# EAGLE design murdock_mcu (EAGLE 6.2)

## Sheet 1 of 2
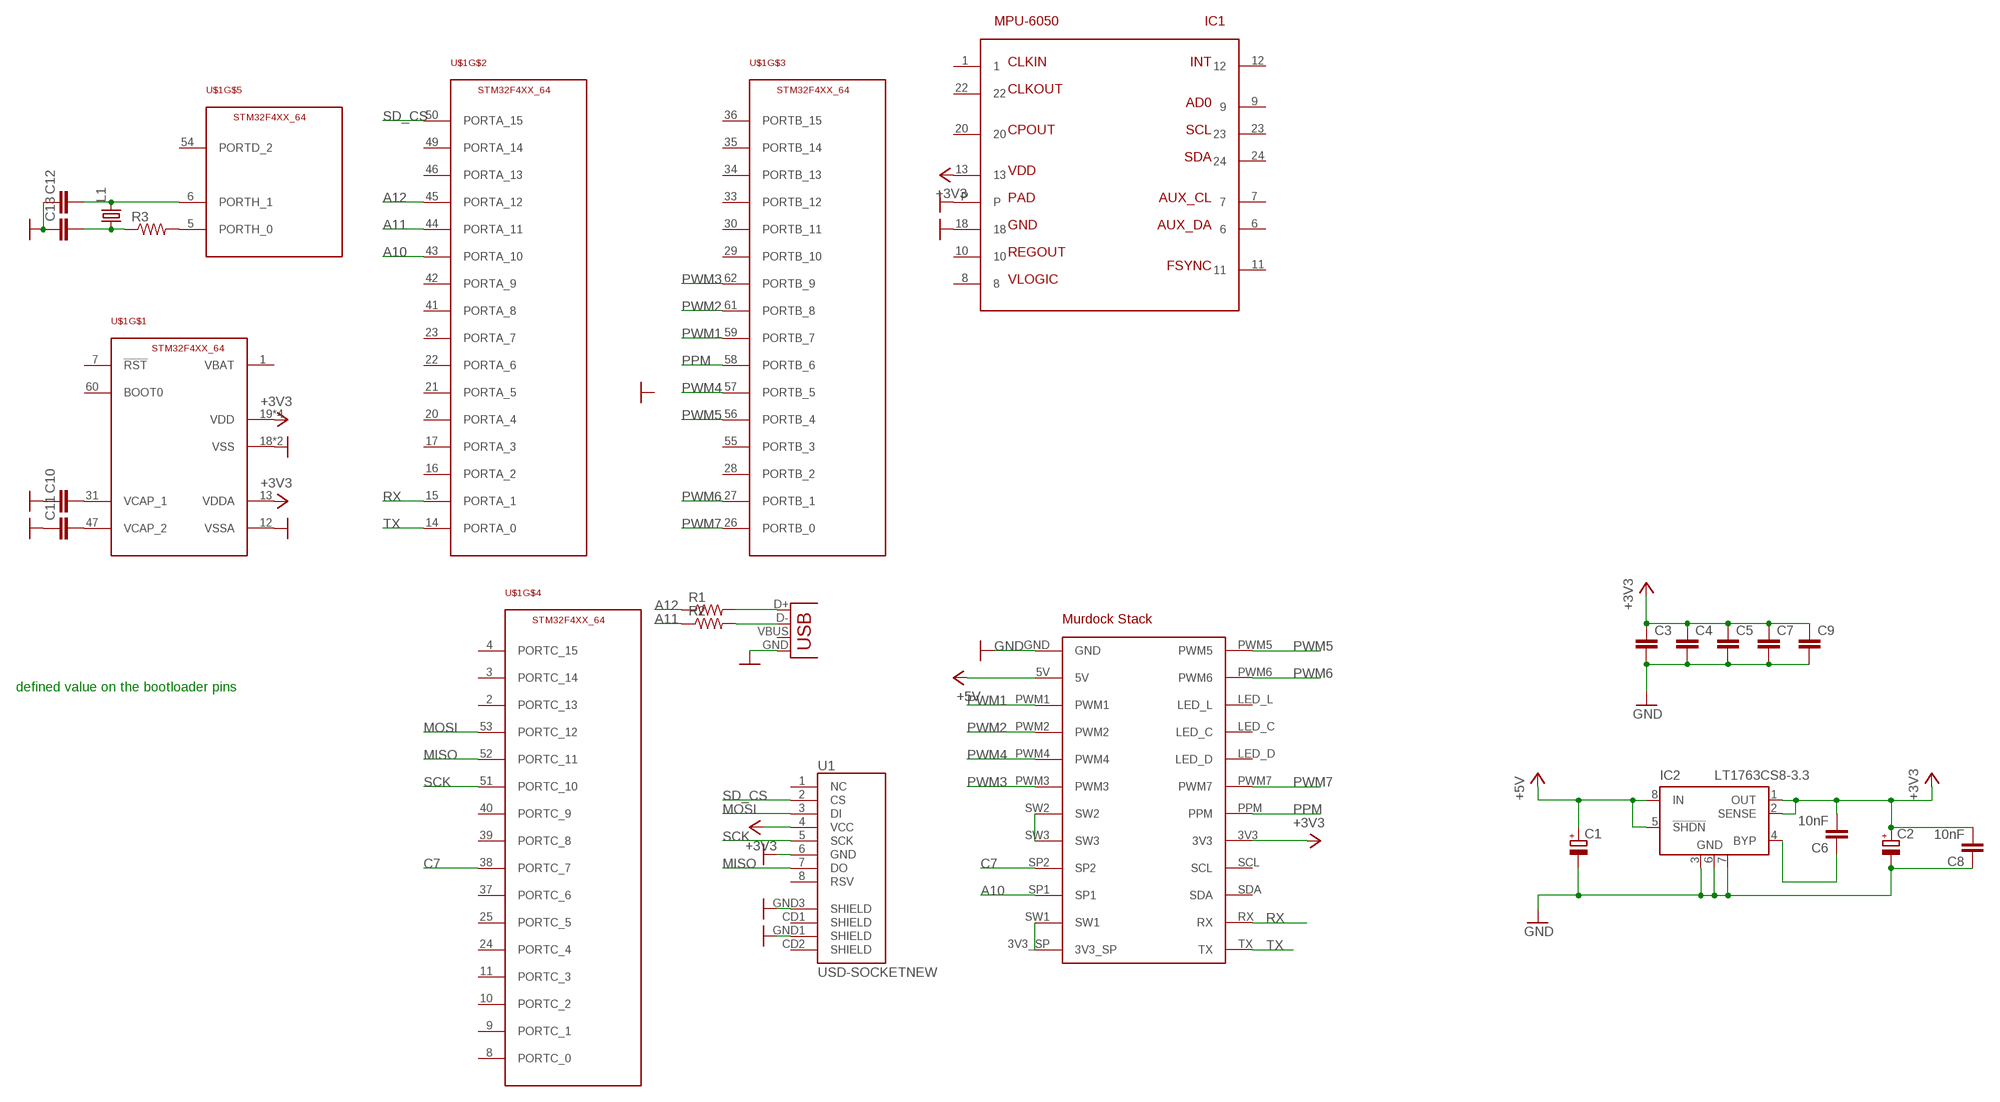
[diagram p0: schematic, sheet 1]

### Parts
C1  CPOL-EUSMCD  [SMC_D]
C2  CPOL-EUSMCD  [SMC_D]
C3  CAP0402-CAP  [0402-CAP]
C4  CAP0402-CAP  [0402-CAP]
C5  CAP0402-CAP  [0402-CAP]
C6  10nF  C-EUC0402  [C0402]
C7  CAP0402-CAP  [0402-CAP]
C8  10nF  C-EUC0402  [C0402]
C9  CAP0402-CAP  [0402-CAP]
C10  CAP0805  [0805]
C11  CAP0805  [0805]
C12  CAP0402-CAP  [0402-CAP]
C13  CAP0402-CAP  [0402-CAP]
IC1  MPU-6050  [QFN24]
IC2  LT1763CS8-3.3  [SOIC8]
L1  X22-OSCILLATOR  [X22]
R1  RESISTOR0402-RES  [0402-RES]
R2  RESISTOR0402-RES  [0402-RES]
R3  RESISTOR0402-RES  [0402-RES]
U1  USD-SOCKETNEW  [MICRO-SD-SOCKET-PP]
U$1  STM32F4XX_64  [TQFP64]
X1  USBSMD  [USB-MINIB]
X2  MURDOCK_STACK  [MURDOCK_STACK]

### Nets
+3V3: C2.+ C3.1 C4.1 C5.1 C6.2 C7.1 C8.2 C9.1 IC1.13 IC2.1(OUT) IC2.2(SENSE) U1.4(VCC) U$1.13(VDDA) U$1.19(VDD) U$1.32(VDD) U$1.48(VDD) U$1.64(VDD) X2.3V3
+5V: C1.+ IC2.5(!SHDN) IC2.8(IN) X2.5V
A10: U$1.43(PORTA_10) X2.SP1
A11: R2.1 U$1.44(PORTA_11)
A12: R1.1 U$1.45(PORTA_12)
C7: U$1.38(PORTC_7) X2.SP2
GND: C1.- C2.- C3.2 C4.2 C5.2 C7.2 C8.1 C9.2 C10.1 C11.1 C12.1 C13.1 IC1.18 IC1.P IC2.3(GND) IC2.6(GND) IC2.7(GND) U1.6(GND) U1.GND1(SHIELD) U1.GND3(SHIELD) U$1.12(VSSA) U$1.18(VSS) U$1.63(VSS) X1.GND X2.GND
MISO: U1.7(DO) U$1.52(PORTC_11)
MOSI: U1.3(DI) U$1.53(PORTC_12)
N$1: R2.2 X1.D-
N$2: R1.2 X1.D+
N$3: C10.2 U$1.31(VCAP_1)
N$4: C11.2 U$1.47(VCAP_2)
N$5: R3.2 U$1.5(PORTH_0)
N$6: C13.2 L1.1 R3.1
N$7: C12.2 L1.3 U$1.6(PORTH_1)
N$8: X2.3V3_SP X2.SW1
N$9: X2.SW2 X2.SW3
N$13: C6.1 IC2.4(BYP)
PPM: U$1.58(PORTB_6) X2.PPM
PWM1: U$1.59(PORTB_7) X2.PWM1
PWM2: U$1.61(PORTB_8) X2.PWM2
PWM3: U$1.62(PORTB_9) X2.PWM3
PWM4: U$1.57(PORTB_5) X2.PWM4
PWM5: U$1.56(PORTB_4) X2.PWM5
PWM6: U$1.27(PORTB_1) X2.PWM6
PWM7: U$1.26(PORTB_0) X2.PWM7
RX: U$1.15(PORTA_1) X2.RX
SCK: U1.5(SCK) U$1.51(PORTC_10)
SD_CS: U1.2(CS) U$1.50(PORTA_15)
TX: U$1.14(PORTA_0) X2.TX
Unconnected: IC1.1 IC1.6 IC1.7 IC1.8 IC1.9 IC1.10 IC1.11 IC1.12 IC1.20 IC1.22 IC1.23 IC1.24 U1.1(NC) U1.8(RSV) U1.CD1(SHIELD) U1.CD2(SHIELD) U$1.1(VBAT) U$1.2(PORTC_13) U$1.3(PORTC_14) U$1.4(PORTC_15) U$1.7(!RST) U$1.8(PORTC_0) U$1.9(PORTC_1) U$1.10(PORTC_2) U$1.11(PORTC_3) U$1.16(PORTA_2) U$1.17(PORTA_3) U$1.20(PORTA_4) U$1.21(PORTA_5) U$1.22(PORTA_6) U$1.23(PORTA_7) U$1.24(PORTC_4) U$1.25(PORTC_5) U$1.28(PORTB_2) U$1.29(PORTB_10) U$1.30(PORTB_11) U$1.33(PORTB_12) U$1.34(PORTB_13) U$1.35(PORTB_14) U$1.36(PORTB_15) U$1.37(PORTC_6) U$1.39(PORTC_8) U$1.40(PORTC_9) U$1.41(PORTA_8) U$1.42(PORTA_9) U$1.46(PORTA_13) U$1.49(PORTA_14) U$1.54(PORTD_2) U$1.55(PORTB_3) U$1.60(BOOT0) X1.VBUS X2.LED_C X2.LED_D X2.LED_L X2.SCL X2.SDA

### Notes on the sheet
- defined value on the bootloader pins

## Sheet 2 of 2

## Library data of the parts
C1 C2 = rcl:CPOL-EU: POLARIZED CAPACITOR, European symbol
C3-C5 C7 C9-C13 = SparkFun-Capacitors:CAP: Capacitor Standard 0603 ceramic capacitor, and 0.1" leaded capacitor.
C6 C8 = rcl:C-EU: CAPACITOR, European symbol
IC1 = seb:MPU-6050
IC2 = linear-technology:LT1763CS8: 500mA, Low Noise, LDO Micropower Regulators Source: http://cds.linear.com/docs/Datasheet/1763ff.pdf
L1 = seb:X22-OSCILLATOR
R1-R3 = SparkFun-Resistors:RESISTOR: Resistor Basic schematic elements and footprints for 0603, 1206, and PTH resistors.
U1 = SparkFun-Connectors:USD-SOCKET: microSD Socket Push-push type uSD socket. Schematic element and footprint production proven. Spark Fun Electronics SKU : PRT-00127. tDoc lines correctly indicate media card edge positions when inserting (unlocked, locked, depressed).
U$1 = stm32:STM32F4XX_64
X1 = SparkFun-Connectors:USB: USB Connectors USB-B-PTH is fully proven SKU : PRT-00139 USB-miniB is fully proven SKU : PRT-00587 USB-A-PCB is untested. USB-A-H is throughly reviewed, but untested. Spark Fun Electronics SKU : PRT-00437 USB-B-SMT is throughly reviewed, but untested. Needs silkscreen touching up. USB-A-S has not been used/tested USB-MB-H has not been used/tested
X2 = murdock:MURDOCK_STACK

## Board
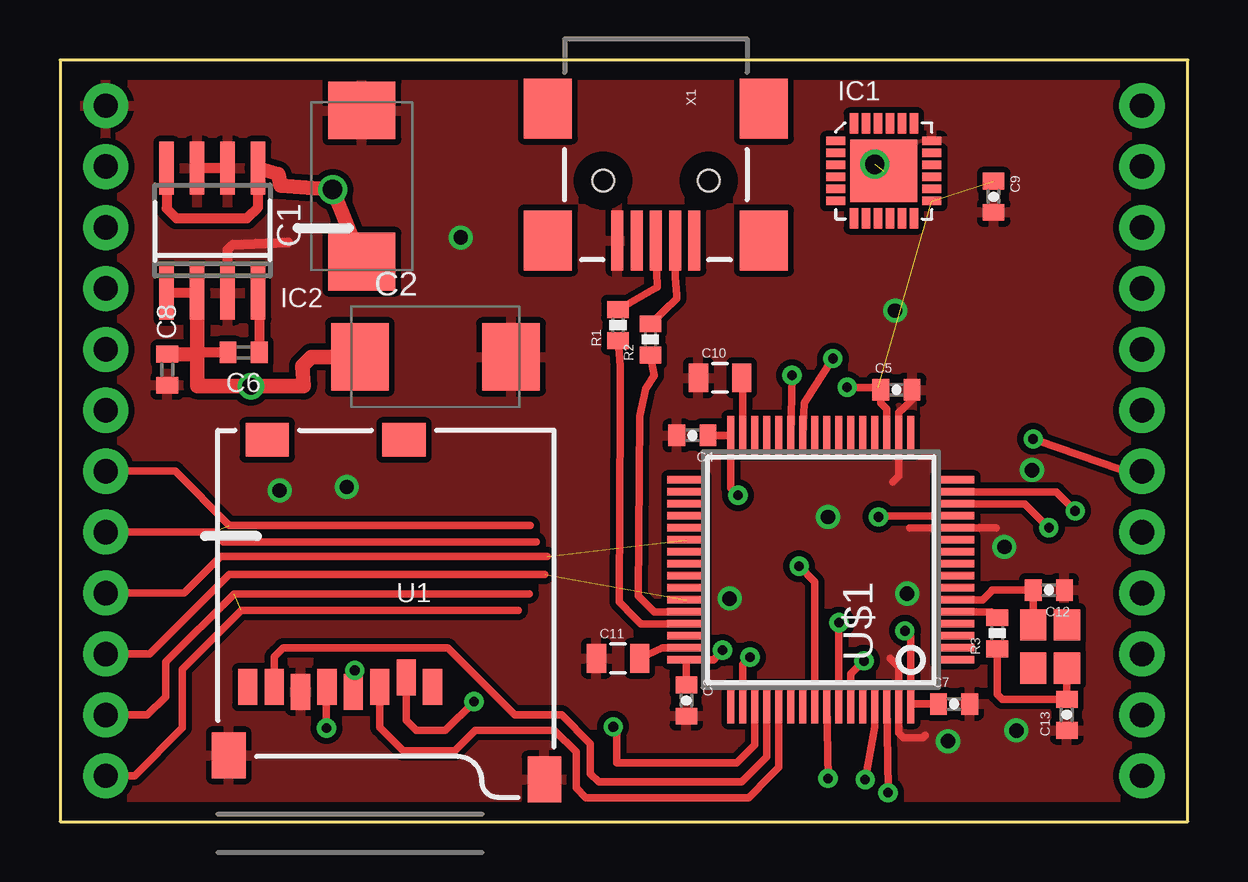
[diagram p1: board, top side]
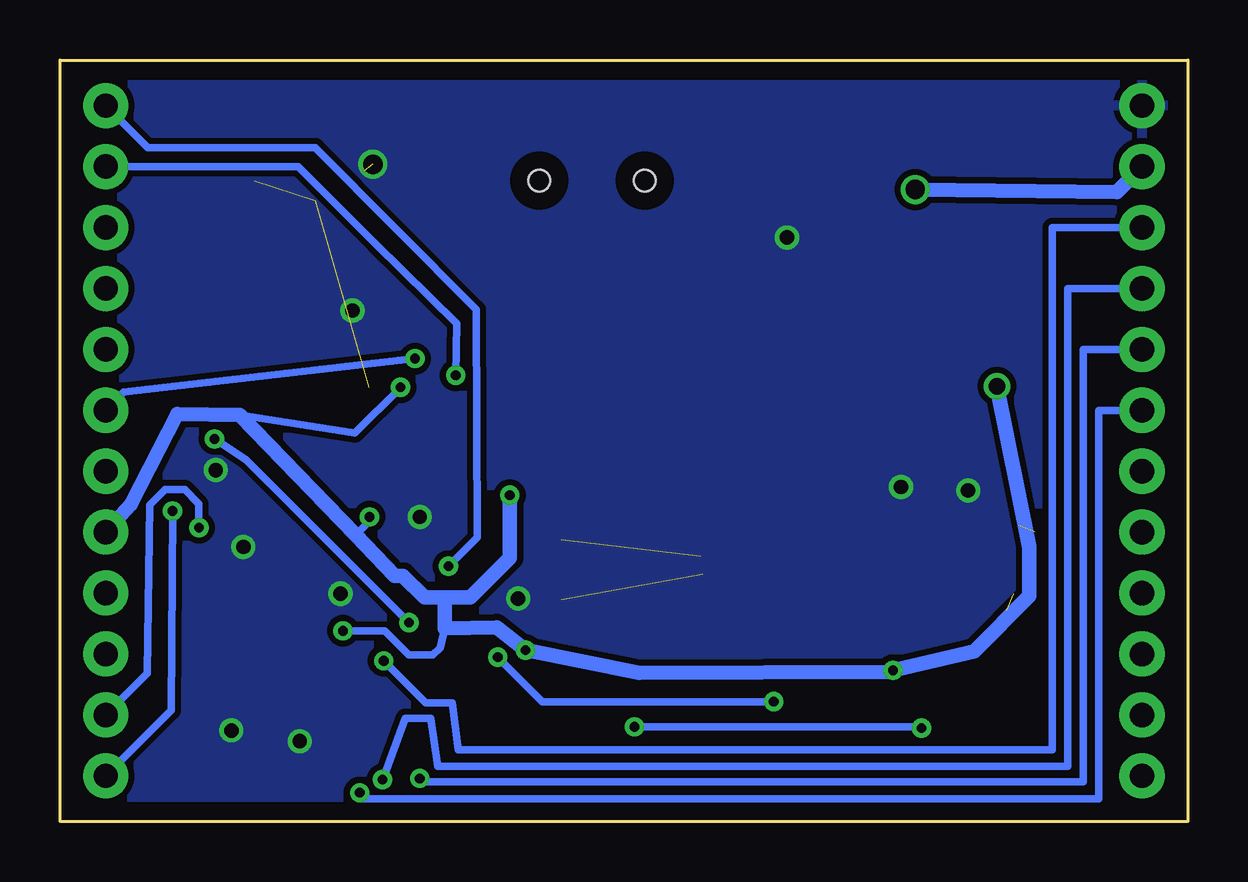
[diagram p2: board, bottom side, seen from below]

Size 46.99 x 31.75 mm. Coordinates in mm from the lower left corner, seen from the top.
Copper layers (1*16): Top 0.035mm / dielectric 1.5mm / Bottom 0.035mm
Design rules: minimum track width 10mil, minimum drill 0.4mm, track to track 8mil, track to pad 8mil, pad to pad 8mil, via to via 8mil, smd to smd 8mil, copper to edge 30mil, drill to drill 8mil, minimum pad ring 10mil, minimum via ring 8mil, stop-mask expansion 4mil, vias tented up to drill 1.5mm, thermal gap 10mil

### Footprints (pad centres in the part's own frame; a part is rotated, then mirrored left to right if it is on the bottom)
SMC_D = smd 2.4 x 2.8: + -3.15,0; - 3.15,0
0402-CAP = smd 0.7 x 0.9: 1 -0.65,0; 2 0.65,0
C0402 = smd 0.7 x 0.9: 1 -0.65,0; 2 0.65,0
0805 = smd 0.8 x 1.2: 1 -0.9,0; 2 0.9,0
QFN24 = smd 0.8 x 0.35: 1 -2,1.25; 2 -2,0.75; 3 -2,0.25; 4 -2,-0.25; 5 -2,-0.75; 6 -2,-1.25; 13 2,-1.25; 14 2,-0.75; 15 2,-0.25; 16 2,0.25; 17 2,0.75; 18 2,1.25 | smd 0.35 x 0.85: 7 -1.25,-1.975; 8 -0.75,-1.975; 9 -0.25,-1.975; 10 0.25,-1.975; 11 0.75,-1.975; 12 1.25,-1.975; 19 1.25,1.975; 20 0.75,1.975; 21 0.25,1.975; 22 -0.25,1.975; 23 -0.75,1.975; 24 -1.25,1.975 | smd 2.8 x 2.6: P 0,0
SOIC8 = smd 0.6 x 2.2: 1 -1.905,-2.6; 2 -0.635,-2.6; 3 0.635,-2.6; 4 1.905,-2.6; 5 1.905,2.6; 6 0.635,2.6; 7 -0.635,2.6; 8 -1.905,2.6
X22 = smd 1.3 x 1.1: 1 0.9,0.7; 2 -0.9,0.7; 3 -0.9,-0.7; 4 0.9,-0.7
0402-RES = smd 0.7 x 0.9: 1 -0.65,0; 2 0.65,0
MICRO-SD-SOCKET-PP = smd 0.8 x 1.5: 1 -8.94,10.7; 2 -7.84,10.3; 3 -6.74,10.7; 4 -5.64,10.9; 5 -4.54,10.7; 6 -3.44,10.9; 7 -2.34,10.7; 8 -1.24,10.7 | smd 1.8 x 1.4: CD1 -2.05,0.4; CD2 -7.75,0.4 | smd 1.4 x 1.9: GND1 -13.6,14.55; GND3 -0.45,13.55
TQFP64 = smd 0.3 x 1.6: 1 -3.75,-5.6; 2 -3.25,-5.6; 3 -2.75,-5.6; 4 -2.25,-5.6; 5 -1.75,-5.6; 6 -1.25,-5.6; 7 -0.75,-5.6; 8 -0.25,-5.6; 9 0.25,-5.6; 10 0.75,-5.6; 11 1.25,-5.6; 12 1.75,-5.6; 13 2.25,-5.6; 14 2.75,-5.6; 15 3.25,-5.6; 16 3.75,-5.6; 33 3.75,5.6; 34 3.25,5.6; 35 2.75,5.6; 36 2.25,5.6; 37 1.75,5.6; 38 1.25,5.6; 39 0.75,5.6; 40 0.25,5.6; 41 -0.25,5.6; 42 -0.75,5.6; 43 -1.25,5.6; 44 -1.75,5.6; 45 -2.25,5.6; 46 -2.75,5.6; 47 -3.25,5.6; 48 -3.75,5.6 | smd 1.6 x 0.3: 17 5.6,-3.75; 18 5.6,-3.25; 19 5.6,-2.75; 20 5.6,-2.25; 21 5.6,-1.75; 22 5.6,-1.25; 23 5.6,-0.75; 24 5.6,-0.25; 25 5.6,0.25; 26 5.6,0.75; 27 5.6,1.25; 28 5.6,1.75; 29 5.6,2.25; 30 5.6,2.75; 31 5.6,3.25; 32 5.6,3.75; 49 -5.6,3.75; 50 -5.6,3.25; 51 -5.6,2.75; 52 -5.6,2.25; 53 -5.6,1.75; 54 -5.6,1.25; 55 -5.6,0.75; 56 -5.6,0.25; 57 -5.6,-0.25; 58 -5.6,-0.75; 59 -5.6,-1.25; 60 -5.6,-1.75; 61 -5.6,-2.25; 62 -5.6,-2.75; 63 -5.6,-3.25; 64 -5.6,-3.75
USB-MINIB = smd 2.5 x 0.5: D+ 2.5,0; D- 2.5,0.8; GND 2.5,-1.6; ID 2.5,-0.8; VBUS 2.5,1.6 | smd 2.5 x 2: MTN1 -3,4.5; MTN2 2.5,4.5; MTN3 -3,-4.5; MTN4 2.5,-4.5 | hole 0.9: 0,2.2; 0,-2.2
MURDOCK_STACK = drill 1.016 pad 1.88: 3V3 19.685,45.085; 3V3_SP 29.845,1.905; 5V 4.445,1.905; GND 1.905,1.905; LED_C 9.525,45.085; LED_D 12.065,45.085; LED_L 6.985,45.085; PPM 17.145,45.085; PWM1 6.985,1.905; PWM2 9.525,1.905; PWM3 14.605,1.905; PWM4 12.065,1.905; PWM5 1.905,45.085; PWM6 4.445,45.085; PWM7 14.605,45.085; RX 29.845,45.085; SCL 22.225,45.085; SDA 24.765,45.085; SP1 24.765,1.905; SP2 22.225,1.905; SW1 27.305,1.905; SW2 17.145,1.905; SW3 19.685,1.905; TX 27.305,45.085

### Placement (x,y rotation side)
C1  12.58,26.49 90 top
C2  15.64,19.37 0 top
C3  26.1,5.05 270 top
C4  26.35,16.1 180 top
C5  34.85,18 0 top
C6  7.65,19.55 180 top
C7  37.25,4.9 0 top
C8  4.47,18.84 90 top
C9  38.9,26.05 270 top
C10  27.5,18.5 0 top
C11  23.25,6.8 0 top
C12  41.2,9.65 180 top
C13  41.95,4.45 90 top
IC1  34.33,27.12 0 top
IC2  6.35,24.64 0 top
L1  41.25,7.3 270 top
R1  23.25,20.7 90 top
R2  24.6,20.1 90 top
R3  39.05,7.85 90 top
U1  6.58,16.31 180 top
U$1  31.7,10.5 90 top
X1  24.83,26.72 270 top
X2  0,31.75 270 top

### Tracks (layer width: path | path; a pad name or v marks a point on that pad's centre or on a via)
+3V3  (via drill 0.4, 0.7)  (2 unrouted)
  Top 0.305: U$1.19 34.45,17.2 34.3,17.35 34.2,17.45 | 34.2,17.45 C5.1 | C3.1 U$1.48 27.25,6.75 v27.6,7.15 | C4.1 U$1.32 27.95,13.9 v28.25,13.6 | 34.2,17.45 C5.1 | C5.1 34.1,18.1 v32.8,18.1 | C7.1 U$1.64 35.45,7.7 v35.2,7.95 | U$1.13 34.15,12.75 v34.1,12.7 | U1.4 12.28,5.47 v12.28,6.3
  Top 0.406: C6.2 5.71,19.55 IC2.2 IC2.1 4.45,22.11
  Top 0.61: 5.71,19.47 5.71,18.27 5.71,19.47 | 5.71,19.47 IC2.2 | C8.2 5.71,19.47 | 5.71,19.47 5.71,18.16 v7.95,18.16 v7.95,18.15 10.15,18.15 10.1,19 10.47,19.37 C2.+
  Bottom 0.305: v32.8,18.1 34.7,16.2 39.5,16.95 | v35.2,7.95 33.45,7.95 32.45,6.95 31.45,6.95 31.15,7.25 30.95,8.05 | v34.1,12.7 34.1,12.52 34.68,11.94 | v12.28,6.3 12.24,6.34 12.1,6.34
  Bottom 0.61: X2.3V3 44.03,13.21 42.1,17 39.5,16.95 34.68,11.94 33.05,10.25 32.7,10.25 31.8,9.35 31.1,9.35 | v28.25,13.6 28.25,11 29.9,9.35 31.1,9.35 | 31.1,9.35 30.95,9.2 30.95,8.05 28.8,8.1 v27.6,7.15 22.85,6.2 12.5,6.25 v12.28,6.3 12.1,6.34 8.9,7.1 6.6,9.4 6.6,11.45 v7.95,18.15
+5V  (via drill 0.8)
  Top 0.406: IC2.8 4.45,25.55 4.85,25.15 7.8,25.15 8.25,25.6 IC2.5
  Top 0.61: IC2.5 9.09,26.98 9.21,26.51 v11.36,26.35 C1.+
  Bottom 0.61: X2.5V 2.96,26.25 v11.36,26.35
A10  (1 unrouted)
  Top 0.305: X2.SP1 3.73,6.99 7.05,10.3 20.2,10.3
A11
  Top 0.305: U$1.44 24.75,8.75 24.1,9.4 24.15,16.9 24.4,18.05 24.75,18.6 R2.1
A12
  Top 0.305: R1.1 23.35,19 23.35,17.15 23.3,9.15 23.95,8.5 24.2,8.25 U$1.45
C7  (1 unrouted)
  Top 0.305: X2.SP2 5.17,9.53 6.7,11.05 20.3,11.05
GND  (via drill 0.6, 0.8)  (1 unrouted)
  Top 0.305: 34.7,14.15 34.95,14.4 U$1.18 34.95,17.05 35.15,17.25 35.5,17.6 C5.2 | U$1.12 37.1,12.25 | 37.1,12.25 35.4,12.25 | 34.6,6.8 34.95,6.45 U$1.63 34.95,3.7 35.15,3.5 35.95,3.5 36.05,3.6 | 39,12.25 37.1,12.25
  Top 0.406: IC2.6 IC2.7 | IC2.3 6.99,23.84 7.2,24.05 9.5,24.15
  other vias: 16.7,24.35 32,12.7 34.8,21.3 33.95,27.4 9.15,13.8 11.95,13.95 27.9,9.3 37,3.35 39.85,3.8 40.5,14.65 39.35,11.45 35.3,9.5
  pour Top (isolate 0.254): 46.99,0 46.99,33.02 -0.95,33.02 -0.95,0
  pour Bottom (isolate 0.254): 46.99,0 46.99,33.02 -0.95,33.02 -0.95,0
MISO
  Top 0.305: U$1.52 29.45,2.7 28.4,1.65 22.45,1.65 22.1,2 22.1,3.25 20.9,4.45 18.95,4.45 16.15,7.25 9.3,7.25 9.05,7 8.92,6.87 U1.7
MOSI
  Top 0.305: U$1.53 29.95,2.25 29.6,1.9 28.7,1 21.9,1 21.5,1.4 21.5,2.9 20.6,3.8 17.3,3.8 16.45,2.95 14.3,2.95 13.55,3.7 13.32,3.93 U1.3
N$1
  Top 0.305: X1.D- 25.63,22.67 25.7,21.95 25.7,21.8 R2.2
N$2
  Top 0.305: R1.2 24.88,22.28 X1.D+
N$3
  Top 0.305: U$1.31 28.45,18.45 C10.2
N$4
  Top 0.305: U$1.47 25.25,7.25 25.1,7.25 C11.2
N$5
  Top 0.305: U$1.5 38.8,8.75 R3.2
N$6
  Top 0.305: R3.1 39.05,5.3 39.25,5.1 C13.2 L1.1
N$7
  Top 0.305: L1.3 C12.2 38.85,9.65 38.8,9.6 38.45,9.25 U$1.6
N$8  (1 unrouted)
  Top 0.305: X2.3V3_SP 3.1,1.91 5.1,3.9 5.1,6.35 7.55,8.8 19.1,8.8 | X2.SW1 3.65,4.45 4.4,5.2 4.4,6.65 7.25,9.5 19.55,9.5
N$9  (1 unrouted)
  Top 0.305: X2.SW3 6.38,12.06 6.8,11.65 19.85,11.65 | X2.SW2 4.79,14.61 7.05,12.35 19.6,12.35
N$13
  Top 0.406: IC2.4 8.3,21.99 C6.1
PPM  (via drill 0.4)
  Top 0.305: v32.45,8.3 U$1.58 | v40.55,15.95 44.35,14.61 X2.PPM
  Bottom 0.305: v32.45,8.3 33.25,9.1 39.25,15.1 v40.55,15.95
PWM1  (via drill 0.4)
  Top 0.305: v33.5,6.7 32.95,6.15 U$1.59
  Bottom 0.305: X2.PWM1 5.65,24.77 5.65,3 30.4,3 30.65,4.95 31.75,4.95 v33.5,6.7
PWM2  (via drill 0.4)
  Top 0.305: v33.55,1.75 33.95,3.95 U$1.61
  Bottom 0.305: X2.PWM2 5,22.23 5,2.3 31.25,2.3 31.55,4.3 32.6,4.3 v33.55,1.75
PWM3  (via drill 0.4)
  Top 0.305: v34.5,1.2 34.5,1.35 U$1.62
  Bottom 0.305: X2.PWM3 3.7,17.14 3.7,0.95 34.5,0.95 v34.5,1.2
PWM4  (via drill 0.4)
  Top 0.305: v32,1.8 U$1.57
  Bottom 0.305: X2.PWM4 4.35,19.68 4.35,1.65 32,1.65 v32,1.8
PWM5  (via drill 0.4)
  Top 0.305: v30.8,10.65 31.45,10 U$1.56
  Bottom 0.305: X2.PWM5 43.34,28.1 36.35,28.1 29.65,21.35 29.6,11.85 v30.8,10.65
PWM6  (via drill 0.4)
  Top 0.305: v30.5,18.6 U$1.27
  Bottom 0.305: X2.PWM6 37.05,27.3 33.85,24.1 30.45,20.75 v30.5,18.6
PWM7  (via drill 0.4)
  Top 0.305: v32.2,19.3 31,17.45 U$1.26
  Bottom 0.305: X2.PWM7 44.33,17.9 v32.2,19.3
RX  (via drill 0.4)
  Top 0.305: U$1.15 41.5,13.75 v42.3,12.95
  Bottom 0.305: v42.3,12.95 42.35,4.64 X2.RX
SCK  (via drill 0.4)
  Top 0.305: U1.5 11.1,5.59 v11.1,3.9 | v23.05,3.95 23.2,3.8 23.2,2.45 28.2,2.45 28.55,2.8 28.95,3.2 U$1.51
  Bottom 0.305: v11.1,3.9 11.15,3.95 v23.05,3.95
SD_CS  (via drill 0.4)
  Top 0.305: U1.2 14.42,4.23 14.85,3.8 16.05,3.8 v17.25,5 | v28.75,6.85 28.45,6.55 U$1.50
  Bottom 0.305: v17.25,5 26.9,5 v28.75,6.85
TX  (via drill 0.4)
  Top 0.305: v41.2,12.25 40.2,13.25 U$1.14
  Bottom 0.305: X2.TX 43.35,6.18 43.25,13.2 42.6,13.85 41.8,13.85 41.2,13.25 v41.2,12.25